# EasyEDA Pro project Madhawa.eprj

# Schematic Project
Create Date: 2023-12-13; Page Name: P1; Project Name: Madhawa; Schematic Name: Schematic1; Update Date: 2024-01-10; Company: EasyEDA.com; Drawed: EasyEDA Pro; Page Size: A4; Part Number: JLCPCB-002; Reviewed: EasyEDA Pro; Version: V0.1
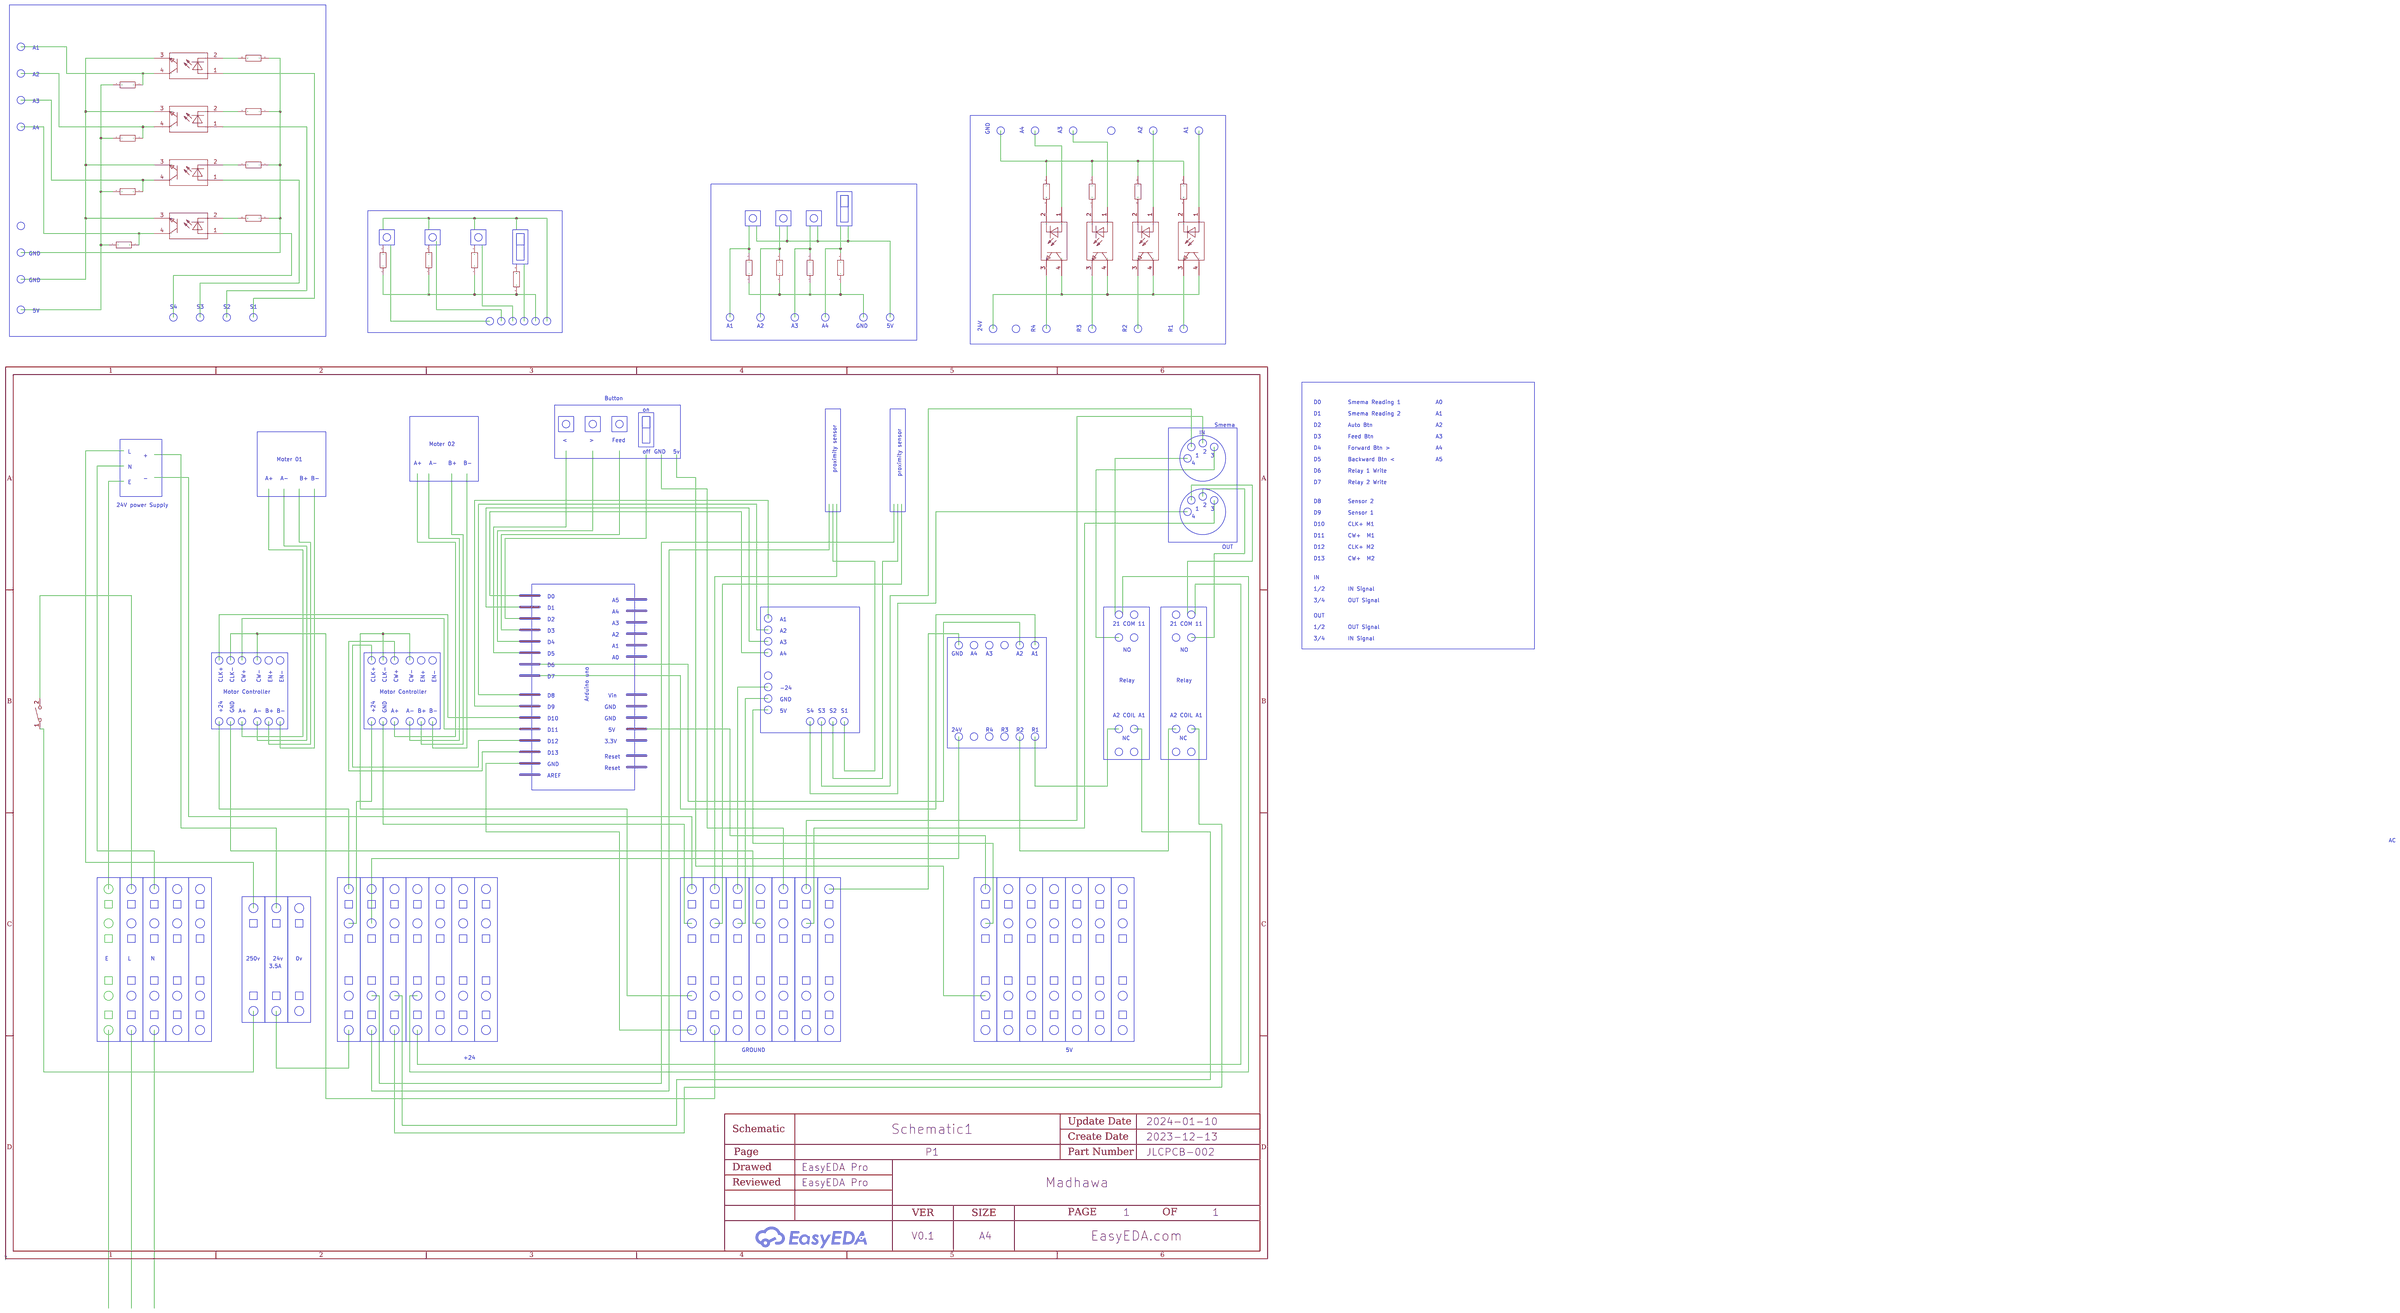
[diagram p0: schematic sheet]

## Parts
KEY1  SWITCH,TACT,1.57N,3.9X2.9MM  [KEY-SMD_L4.0-W3.0-LS4.9-1]
R1  10K  [R0603]
R2  10K  [R0603]
R3  10K  [R0603]
R4  10K  [R0603]
R9  10K  [R0603]
R10  10K  [R0603]
R11  10K  [R0603]
R12  10K  [R0603]
R13  10K  [R0603]
R14  10K  [R0603]
R15  10K  [R0603]
R16  10K  [R0603]
R17  10K  [R0603]
R18  10K  [R0603]
R19  10K  [R0603]
R20  10K  [R0603]
R21  10K  [R0603]
R22  10K  [R0603]
R23  10K  [R0603]
R24  10K  [R0603]
U1  PC817X4NIP0F(D档)  [OPTO-SMD-4_L4.6-W6.5-P2.54-LS10.3-BL]
U2  PC817X4NIP0F(D档)  [OPTO-SMD-4_L4.6-W6.5-P2.54-LS10.3-BL]
U3  PC817X4NIP0F(D档)  [OPTO-SMD-4_L4.6-W6.5-P2.54-LS10.3-BL]
U4  PC817X4NIP0F(D档)  [OPTO-SMD-4_L4.6-W6.5-P2.54-LS10.3-BL]
U5  PC817X4NIP0F(D档)  [OPTO-SMD-4_L4.6-W6.5-P2.54-LS10.3-BL]
U6  PC817X4NIP0F(D档)  [OPTO-SMD-4_L4.6-W6.5-P2.54-LS10.3-BL]
U7  PC817X4NIP0F(D档)  [OPTO-SMD-4_L4.6-W6.5-P2.54-LS10.3-BL]
U8  PC817X4NIP0F(D档)  [OPTO-SMD-4_L4.6-W6.5-P2.54-LS10.3-BL]

## Library data of the parts
KEY1 = SWITCH,TACT,1.57N,3.9X2.9MM: Supplier Part: C9900022258; Supplier Footprint: SW-SMD_2P-L4.0-W3.0; Datasheet: https://atta.szlcsc.comnull; Supplier: LCSC
R1-R4 R9-R24 = Res_0603: Supplier Footprint: 0603
U1-U8 = PC817X4NIP0F(D档): LCSC Part Name: PC817X4NIP0F(D档)  停产; Supplier Part: C97428; Supplier Footprint: SMD-4; JLCPCB Part Class: Extended Part; Datasheet: https://atta.szlcsc.com/upload/public/pdf/source/20170306/1488763833610.pdf; Supplier: LCSC

## Nets
Net-(R1-1): R1.1 R2.1 R3.1 R4.1
Net-(R9-1): R9.1 R10.1 R11.1 R12.1
Net-(R9-2): R9.2 U1.2
Net-(R10-2): R10.2 U2.2
Net-(R11-2): R11.2 U3.2
Net-(R12-2): R12.2 U4.2
Net-(R13-1): R13.1 U1.4
Net-(R13-2): R13.2 R14.2 R15.2 R16.2
Net-(R14-1): R14.1 U2.4
Net-(R15-1): R15.1 U3.4
Net-(R16-1): R16.1 U4.4
Net-(R17-1): R17.1 R18.1 R19.1 R20.1
Net-(R17-2): R17.2 U5.2
Net-(R18-2): R18.2 U6.2
Net-(R19-2): R19.2 U7.2
Net-(R20-2): R20.2 U8.2
Net-(R21-1): R21.1 R22.1 R23.1 R24.1
Net-(U1-3): U1.3 U2.3 U3.3 U4.3
Net-(U5-4): U5.4 U6.4 U7.4 U8.4

Not connected (* = marked no-connect by the designer): KEY1 1 2; R1 2; R2 2; R3 2; R4 2; R21 2; R22 2; R23 2; R24 2; U1 1; U2 1; U3 1; U4 1; U5 1 3; U6 1 3; U7 1 3; U8 1 3

## Notes on the sheet
- A1
- A2
- A3
- GND
- A4
- A4
- A3
- A2
- A1
- GND
- GND
- 5V
- S4
- S3
- S2
- S1
- 24V
- A1
- A2
- A3
- A4
- GND
- 5V
- R4
- R3
- R2
- R1
- Button
- D0
- Smema Reading 1
- A0
- on
- D1
- Smema Reading 2
- A1
- Smema
- D2
- Auto Btn
- A2
- IN
- D3
- Feed Btn
- A3
- Moter 02
- <
- >
- Feed
- L
- +
- off
- GND
- 5v
- 1
- 2
- 3
- D4
- Forward Btn >
- A4
- Moter 01
- A+
- A-
- B+
- B-
- 4
- D5
- Backward Btn <
- A5
- N
- proximity sensor
- proximity sensor
- D6
- Relay 1 Write
- E
- -
- A+
- A-
- B+
- B-
- D7
- Relay 2 Write
- D8
- Sensor 2
- 24V power Supply
- 1
- 2
- 3
- 4
- D9
- Sensor 1
- D10
- CLK+ M1
- D11
- CW+  M1
- OUT
- D12
- CLK+ M2
- D13
- CW+  M2
- IN
- 1/2
- IN Signal
- D0
- A5
- 3/4
- OUT Signal
- D1
- A4
- OUT
- D2
- A3
- A1
- 21 COM 11
- 21 COM 11
- 1/2
- OUT Signal
- D3
- A2
- A2
- D4
- A3
- 3/4
- IN Signal
- D5
- A1
- A4
- GND
- A4
- A3
- A2
- A1
- NO
- NO
- A0
- D6
- CLK+
- CLK-
- CW+
- CW-
- EN+
- EN-
- CLK+
- CLK-
- CW+
- CW-
- EN+
- EN-
- D7
- Relay
- Relay
- -24
- Motor Controller
- Motor Controller
- D8
- Arduino uno
- Vin
- GND
- D9
- GND
- +24
- GND
- A+
- A-
- B+
- B-
- +24
- GND
- A+
- A-
- B+
- B-
- 5V
- S4
- S3
- S2
- S1
- A2 COIL A1
- A2 COIL A1
- D10
- GND
- D11
- 5V
- 24V
- R4
- R3
- R2
- R1
- NC
- NC
- D12
- 3.3V
- D13
- Reset
- GND
- Reset
- AREF
- AC
- E
- L
- N
- 250v
- 24v
- 0v
- 3.5A
- GROUND
- 5V
- +24

# Schematic Power Circut
Create Date: 2024-01-08; Page Name: P1; Project Name: Madhawa; Schematic Name: Schematic2; Update Date: 2024-01-08; Company: EasyEDA.com; Drawed: EasyEDA Pro; Page Size: A4; Part Number: JLCPCB-002; Reviewed: EasyEDA Pro; Version: V0.1
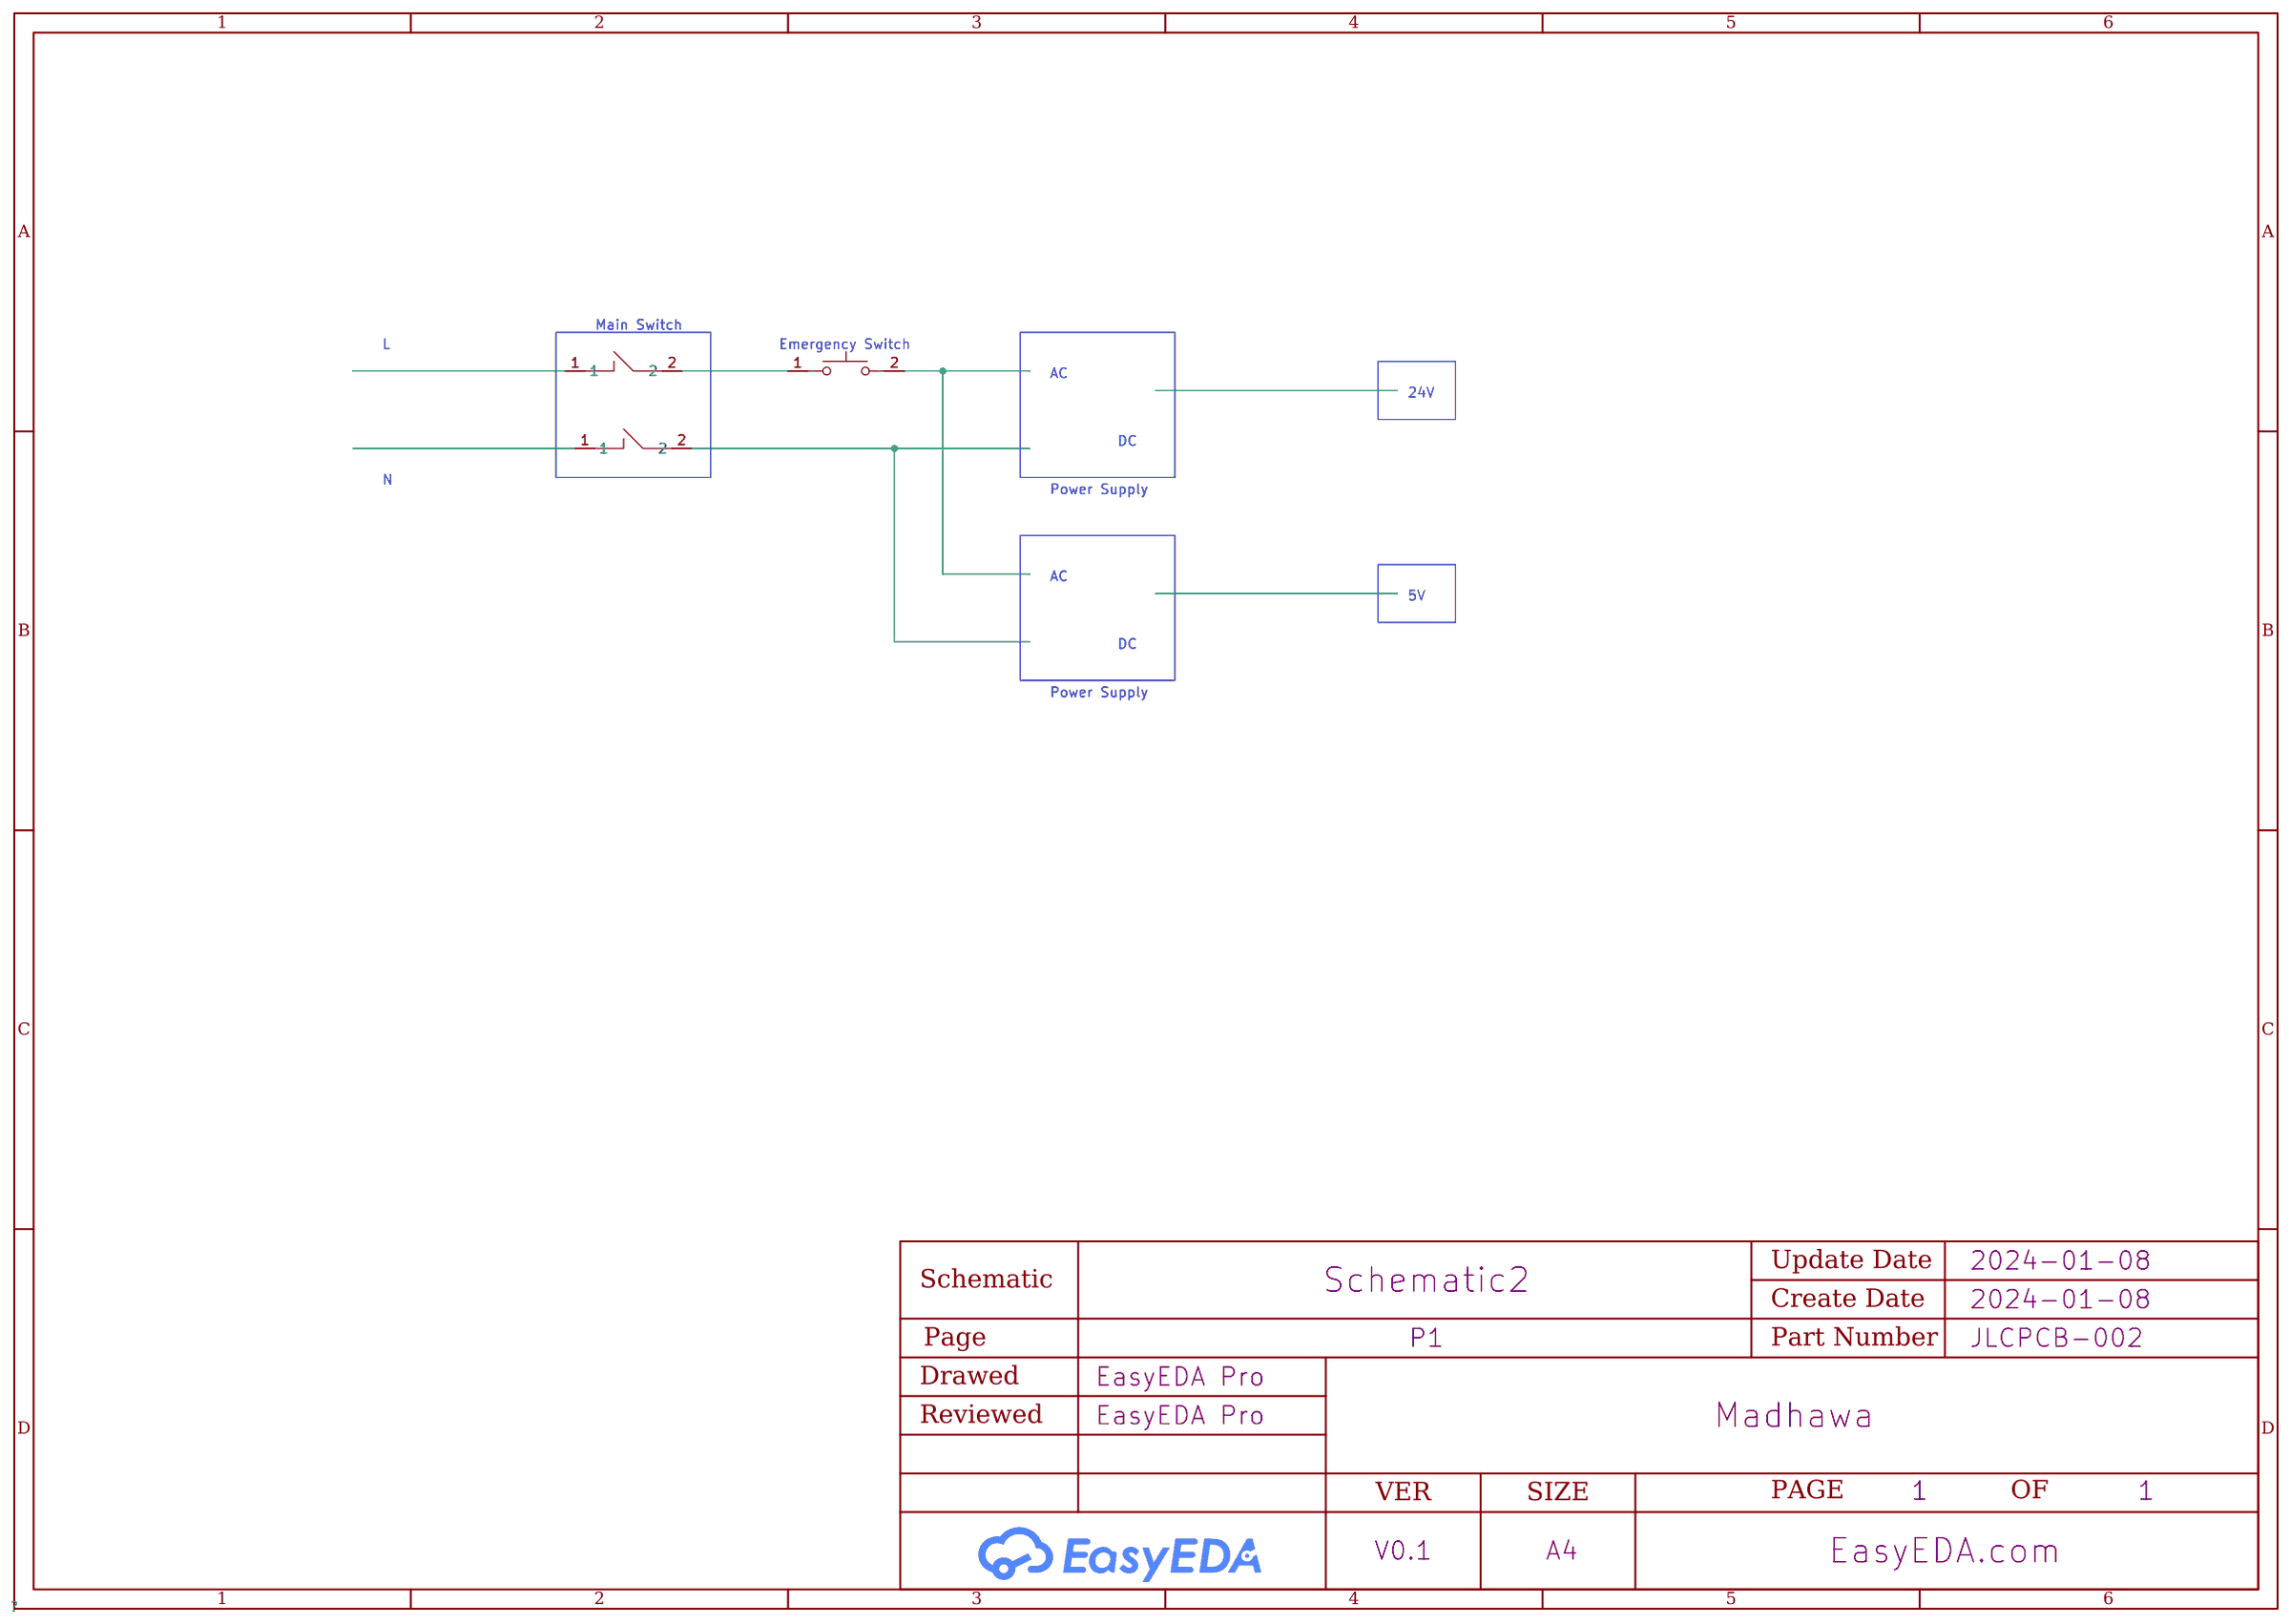
[diagram p1: schematic sheet]

## Parts
U1  SWITCH  [SW-SMD_L11.5-W2.3-LS15.5]
U2  SWITCH  [SW-SMD_L11.5-W2.3-LS15.5]
U3  BUTTON2  [SW-SMD_L6.0-W3.5-LS8.0-1]

## Library data of the parts
U1 U2 = SWITCH: Supplier Part: C9900011059; Supplier Footprint: SW-SMD; Supplier: LCSC
U3 = BUTTON2: Supplier Part: C9900005988; Supplier Footprint: SMD-2_L6.0-W3.5-LS8.0; Datasheet: https://atta.szlcsc.comnull; Supplier: LCSC

## Nets
Net-(U1-2): U1.2 U3.1

Not connected (* = marked no-connect by the designer): U1 1; U2 1 2; U3 2

## Notes on the sheet
- Main Switch
- L
- Emergency Switch
- AC
- 24V
- DC
- N
- Power Supply
- AC
- 5V
- DC
- Power Supply

# Schematic Optocoupler Isolation Circuit
Create Date: 2024-01-16; Page Name: P1; Project Name: Madhawa; Schematic Name: Schematic1; Update Date: 2024-01-16; Company: EasyEDA.com; Drawed: EasyEDA Pro; Page Size: A4; Part Number: JLCPCB-002; Reviewed: EasyEDA Pro; Version: V0.1
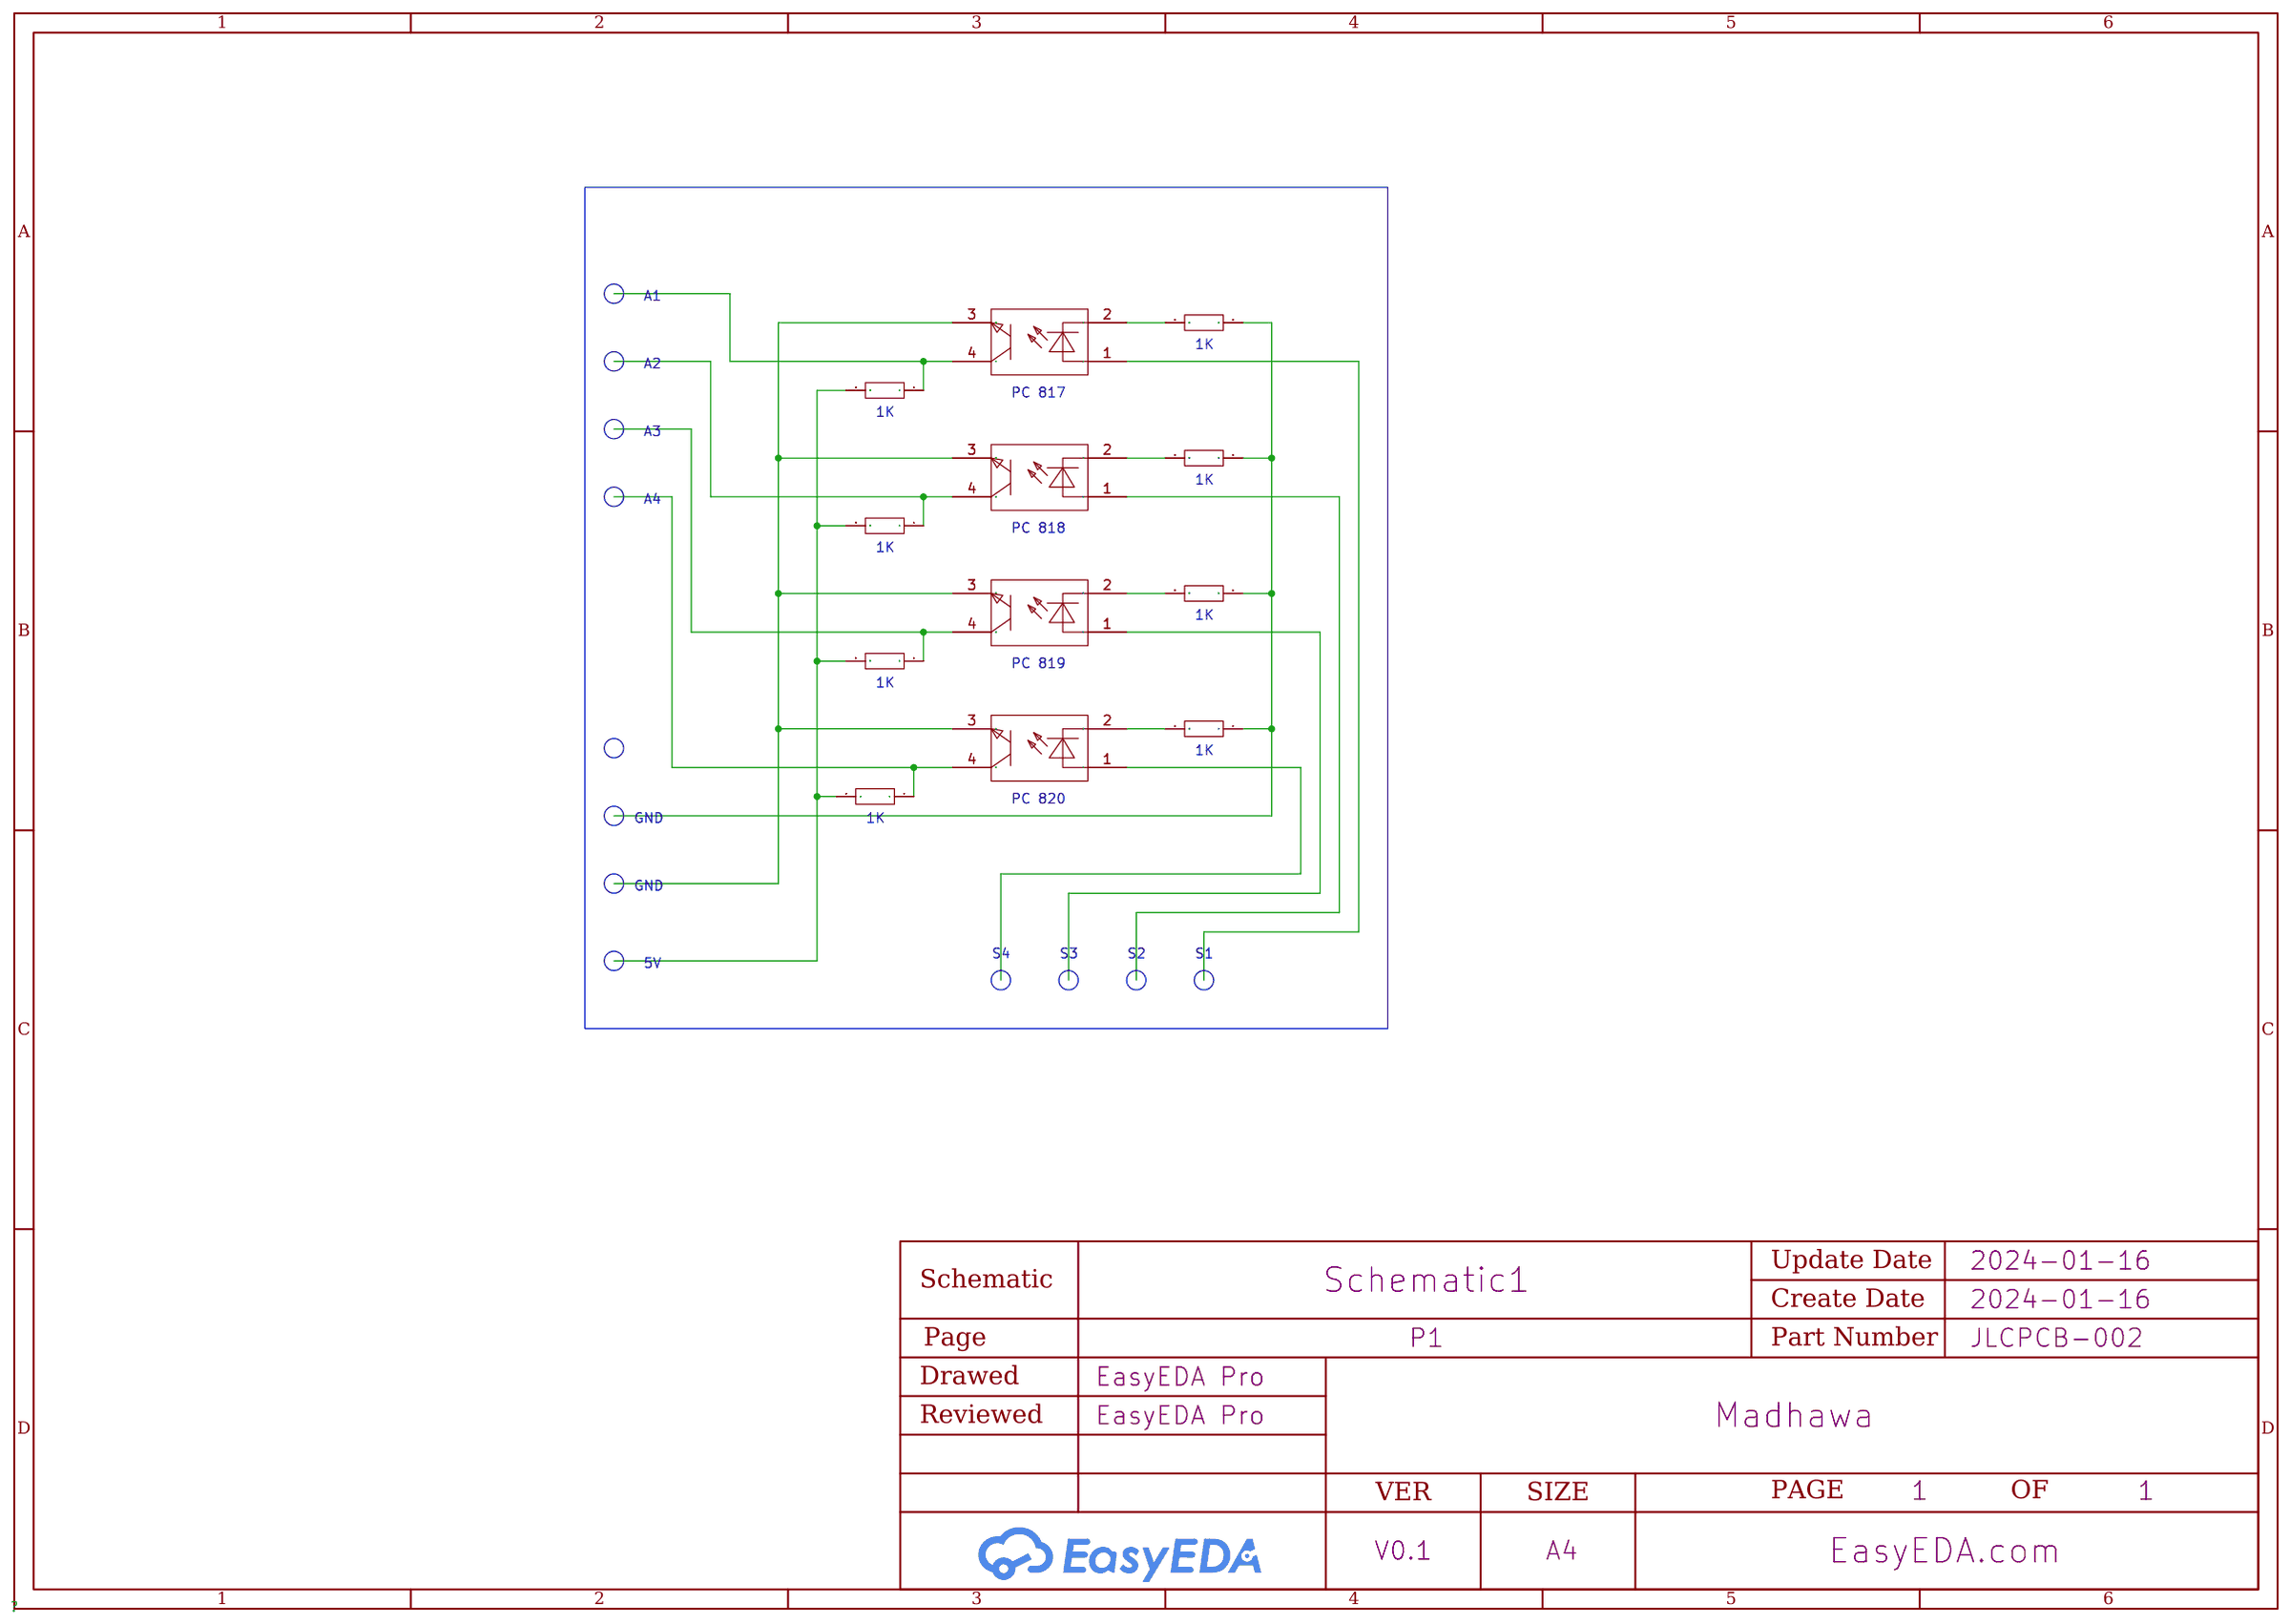
[diagram p2: schematic sheet]

## Parts
R9  10K  [R0603]
R10  10K  [R0603]
R11  10K  [R0603]
R12  10K  [R0603]
R13  10K  [R0603]
R14  10K  [R0603]
R15  10K  [R0603]
R16  10K  [R0603]
U1  PC817X4NIP0F(D档)  [OPTO-SMD-4_L4.6-W6.5-P2.54-LS10.3-BL]
U2  PC817X4NIP0F(D档)  [OPTO-SMD-4_L4.6-W6.5-P2.54-LS10.3-BL]
U3  PC817X4NIP0F(D档)  [OPTO-SMD-4_L4.6-W6.5-P2.54-LS10.3-BL]
U4  PC817X4NIP0F(D档)  [OPTO-SMD-4_L4.6-W6.5-P2.54-LS10.3-BL]

## Library data of the parts
R9-R16 = Res_0603: Supplier Footprint: 0603
U1-U4 = PC817X4NIP0F(D档): LCSC Part Name: PC817X4NIP0F(D档)  停产; Supplier Part: C97428; Supplier Footprint: SMD-4; JLCPCB Part Class: Extended Part; Datasheet: https://atta.szlcsc.com/upload/public/pdf/source/20170306/1488763833610.pdf; Supplier: LCSC

## Nets
Net-(R9-1): R9.1 R10.1 R11.1 R12.1
Net-(R9-2): R9.2 U1.2
Net-(R10-2): R10.2 U2.2
Net-(R11-2): R11.2 U3.2
Net-(R12-2): R12.2 U4.2
Net-(R13-1): R13.1 U1.4
Net-(R13-2): R13.2 R14.2 R15.2 R16.2
Net-(R14-1): R14.1 U2.4
Net-(R15-1): R15.1 U3.4
Net-(R16-1): R16.1 U4.4
Net-(U1-3): U1.3 U2.3 U3.3 U4.3

Not connected (* = marked no-connect by the designer): U1 1; U2 1; U3 1; U4 1

## Notes on the sheet
- A1
- 1K
- A2
- PC 817
- 1K
- A3
- 1K
- A4
- PC 818
- 1K
- 1K
- PC 819
- 1K
- 1K
- PC 820
- GND
- 1K
- GND
- S4
- S3
- S2
- S1
- 5V

# Schematic Button
Create Date: 2024-01-16; Page Name: P1; Project Name: Madhawa; Schematic Name: Schematic1; Update Date: 2024-01-16; Company: EasyEDA.com; Drawed: EasyEDA Pro; Page Size: A4; Part Number: JLCPCB-002; Reviewed: EasyEDA Pro; Version: V0.1
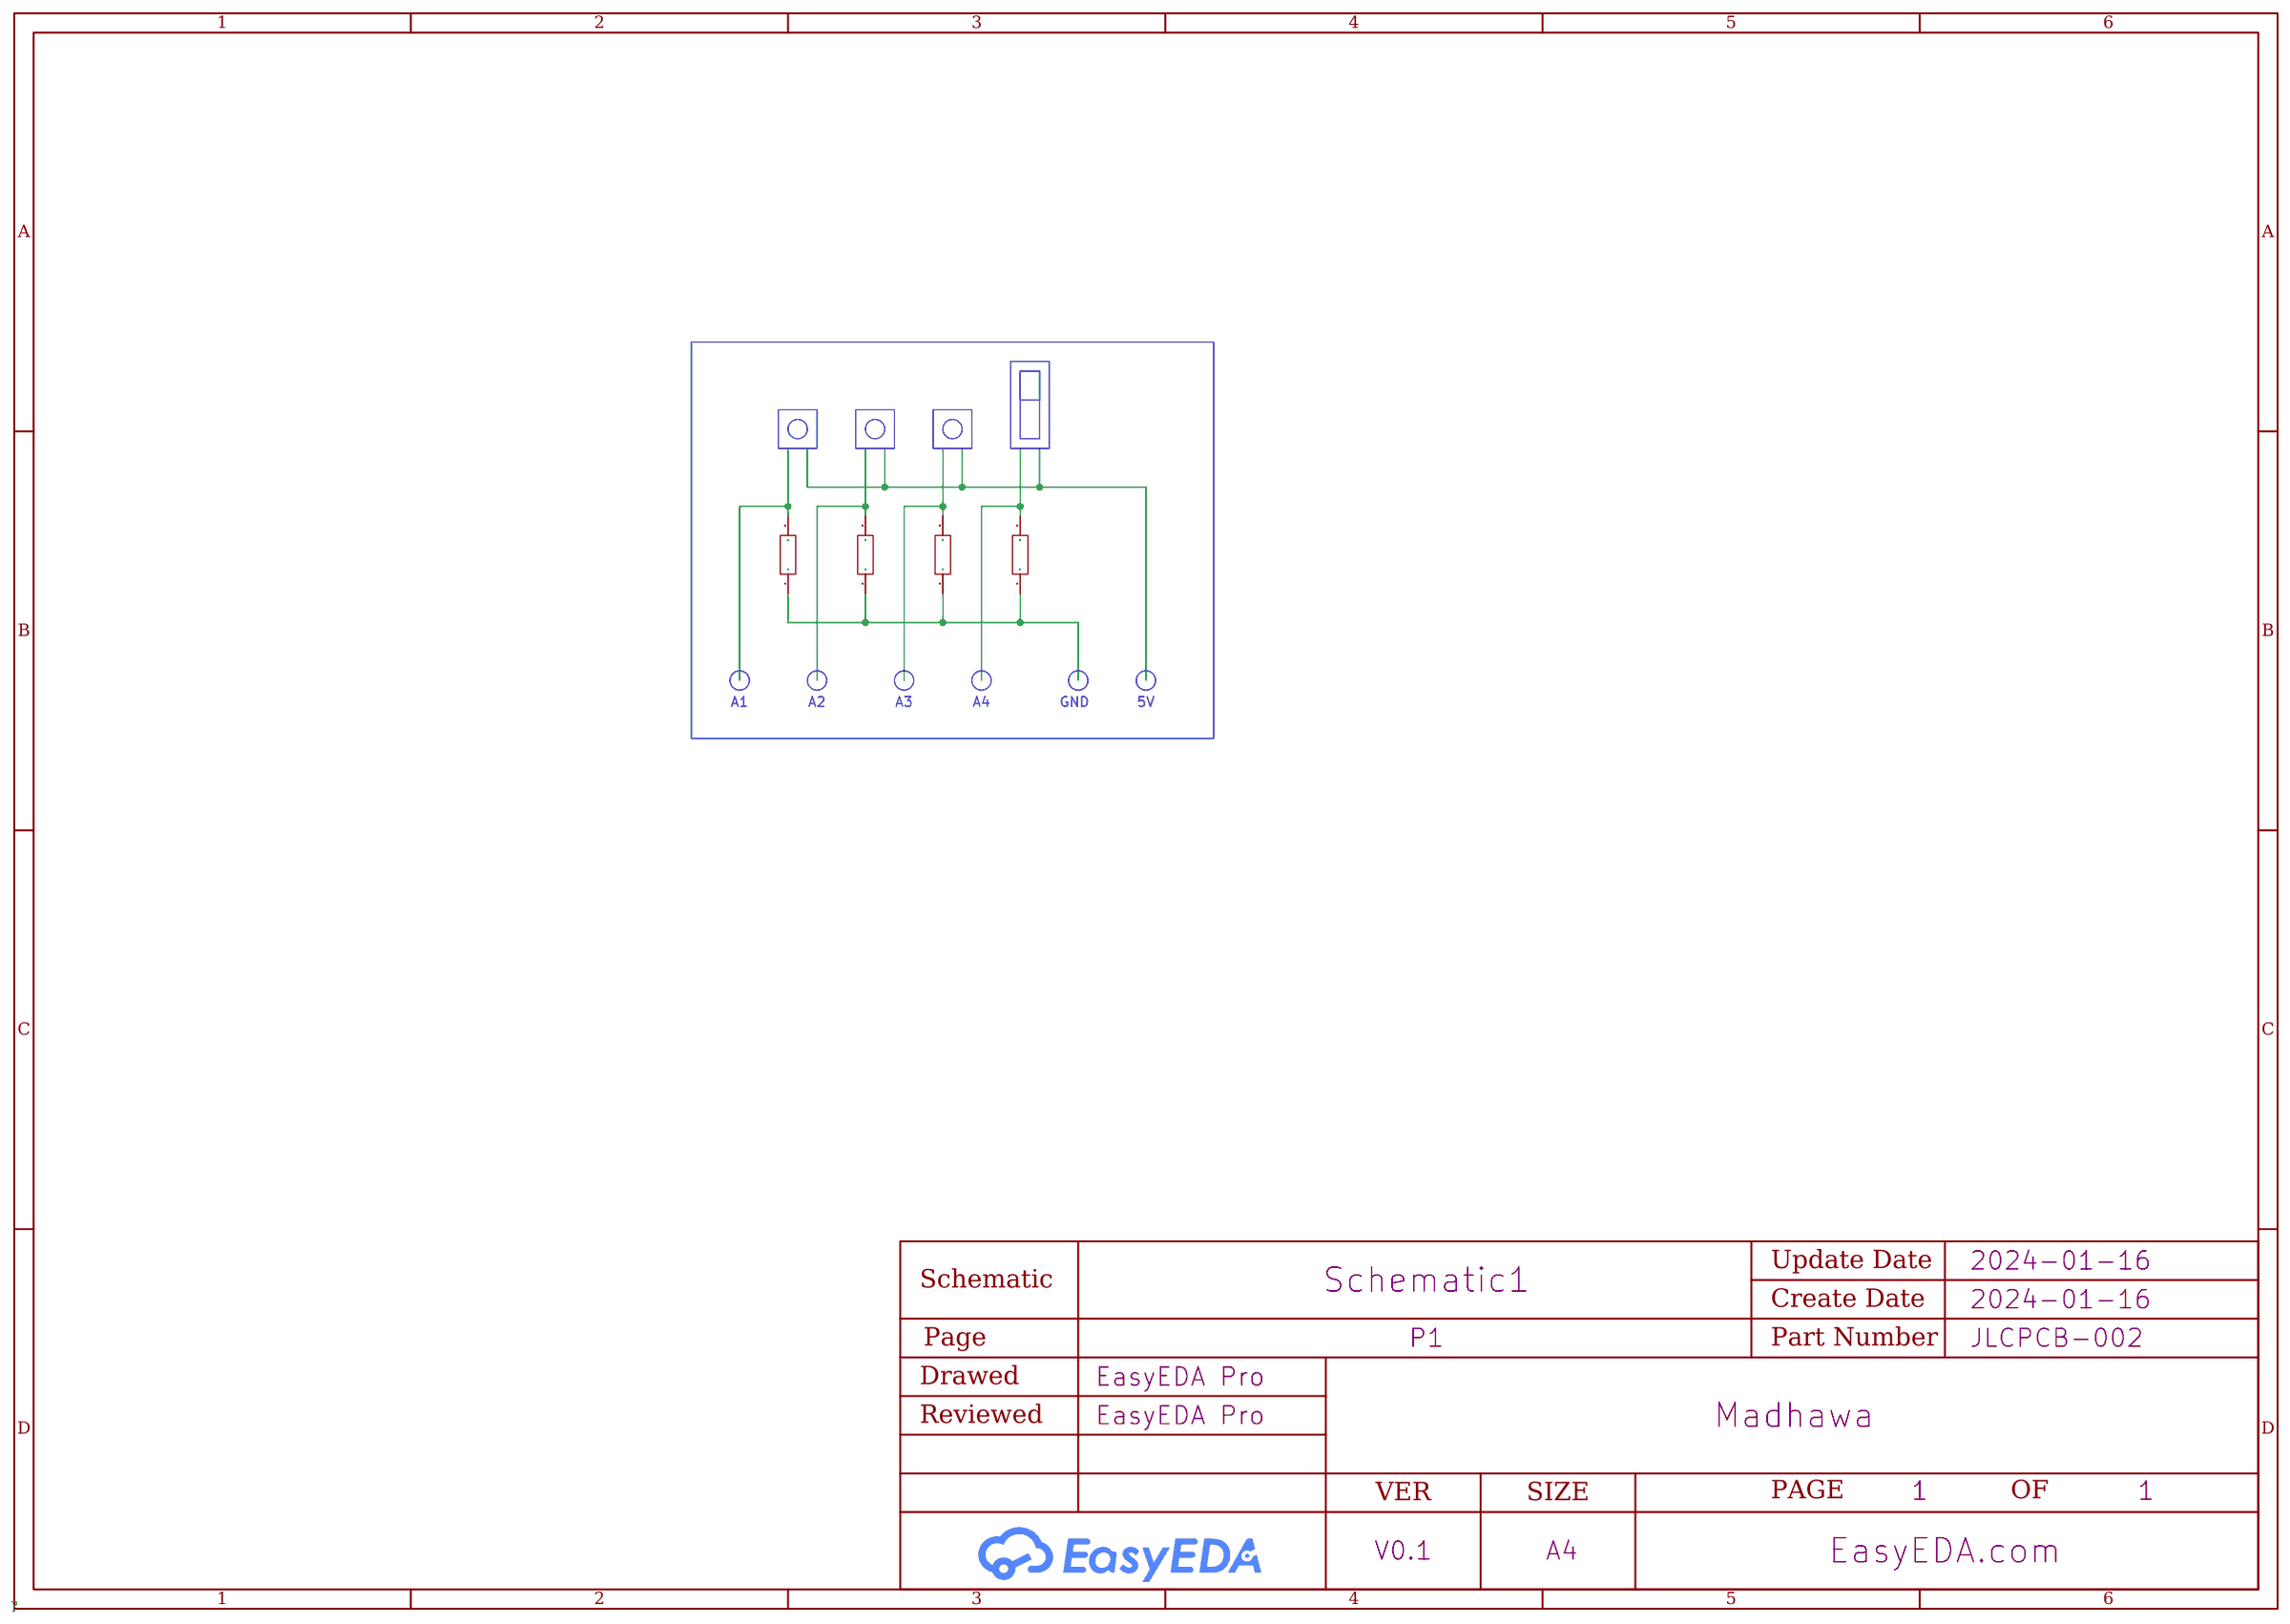
[diagram p3: schematic sheet]

## Parts
R21  10K  [R0603]
R22  10K  [R0603]
R23  10K  [R0603]
R24  10K  [R0603]

## Library data of the parts
R21-R24 = Res_0603: Supplier Footprint: 0603

## Nets
Net-(R21-1): R21.1 R22.1 R23.1 R24.1

Not connected (* = marked no-connect by the designer): R21 2; R22 2; R23 2; R24 2

## Notes on the sheet
- A1
- A2
- A3
- A4
- GND
- 5V

# Schematic Optocoupler Smema Signals
Create Date: 2024-01-16; Page Name: P1; Project Name: Madhawa; Schematic Name: Schematic1; Update Date: 2024-01-16; Company: EasyEDA.com; Drawed: EasyEDA Pro; Page Size: A4; Part Number: JLCPCB-002; Reviewed: EasyEDA Pro; Version: V0.1
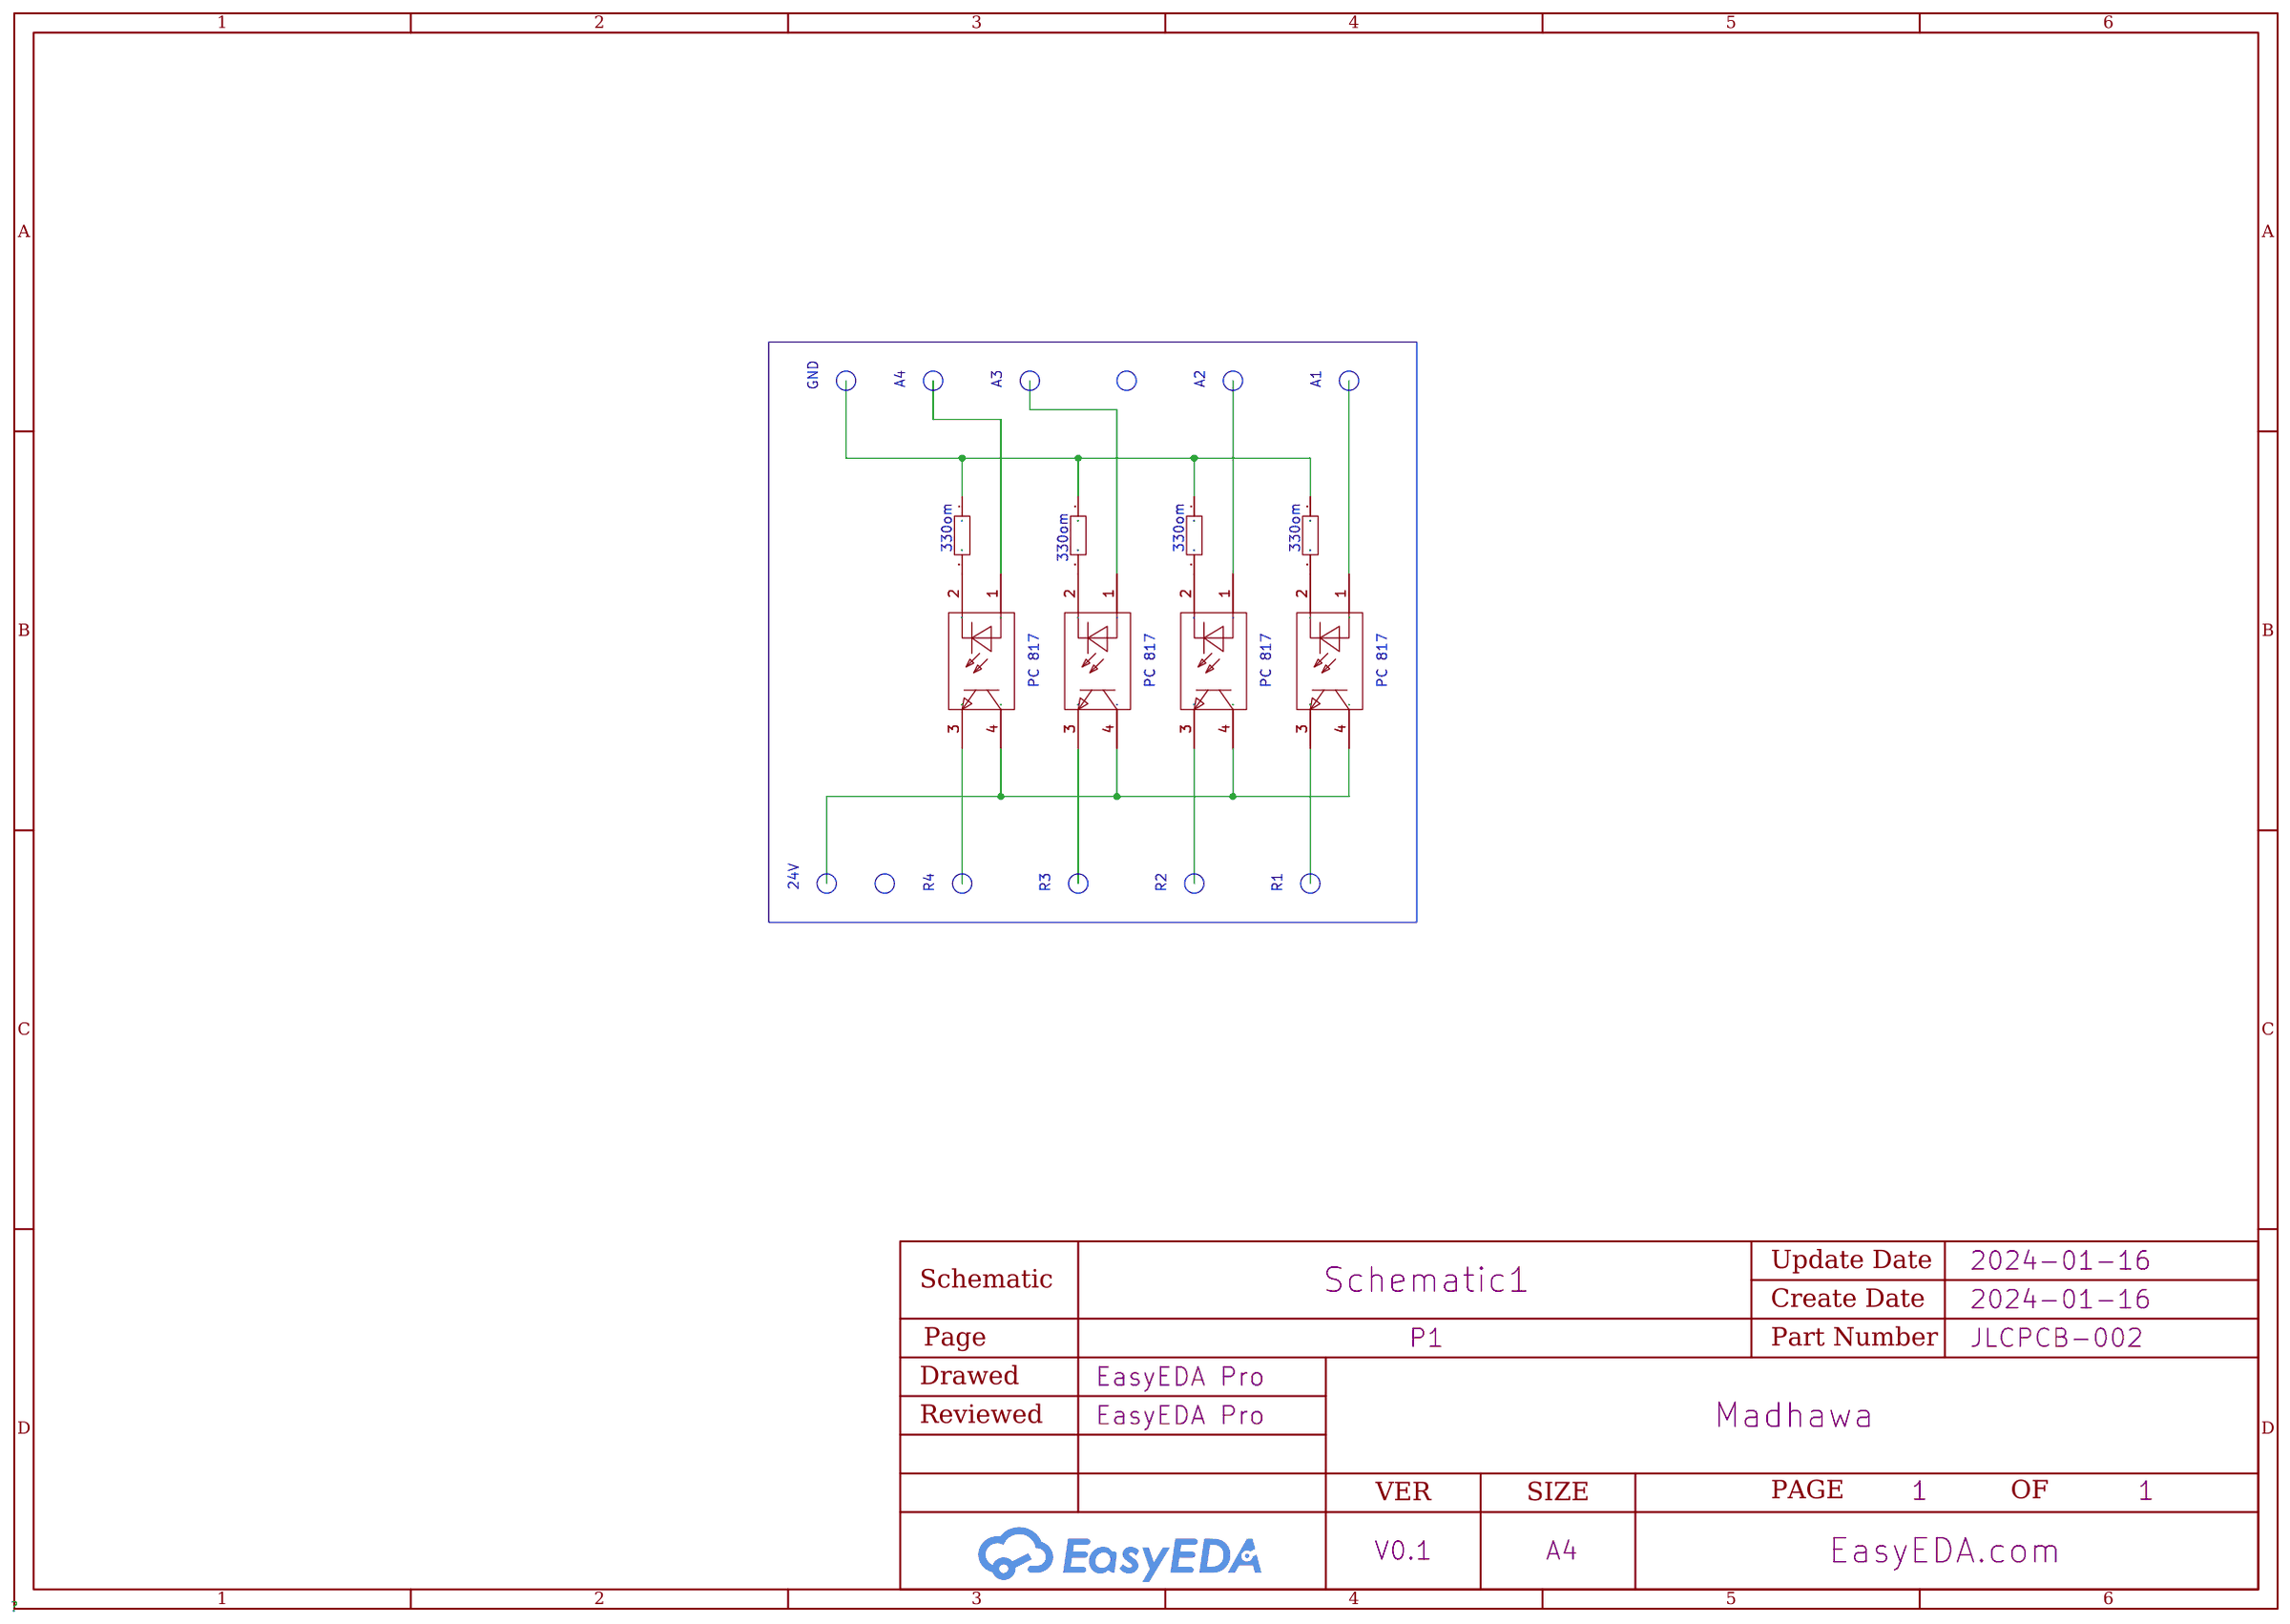
[diagram p4: schematic sheet]

## Parts
R17  10K  [R0603]
R18  10K  [R0603]
R19  10K  [R0603]
R20  10K  [R0603]
U5  PC817X4NIP0F(D档)  [OPTO-SMD-4_L4.6-W6.5-P2.54-LS10.3-BL]
U6  PC817X4NIP0F(D档)  [OPTO-SMD-4_L4.6-W6.5-P2.54-LS10.3-BL]
U7  PC817X4NIP0F(D档)  [OPTO-SMD-4_L4.6-W6.5-P2.54-LS10.3-BL]
U8  PC817X4NIP0F(D档)  [OPTO-SMD-4_L4.6-W6.5-P2.54-LS10.3-BL]

## Library data of the parts
R17-R20 = Res_0603: Supplier Footprint: 0603
U5-U8 = PC817X4NIP0F(D档): LCSC Part Name: PC817X4NIP0F(D档)  停产; Supplier Part: C97428; Supplier Footprint: SMD-4; JLCPCB Part Class: Extended Part; Datasheet: https://atta.szlcsc.com/upload/public/pdf/source/20170306/1488763833610.pdf; Supplier: LCSC

## Nets
Net-(R17-1): R17.1 R18.1 R19.1 R20.1
Net-(R17-2): R17.2 U5.2
Net-(R18-2): R18.2 U6.2
Net-(R19-2): R19.2 U7.2
Net-(R20-2): R20.2 U8.2
Net-(U5-4): U5.4 U6.4 U7.4 U8.4

Not connected (* = marked no-connect by the designer): U5 1 3; U6 1 3; U7 1 3; U8 1 3

## Notes on the sheet
- GND
- A4
- A3
- A2
- A1
- 330om
- 330om
- 330om
- 330om
- PC 817
- PC 817
- PC 817
- PC 817
- 24V
- R4
- R3
- R2
- R1
